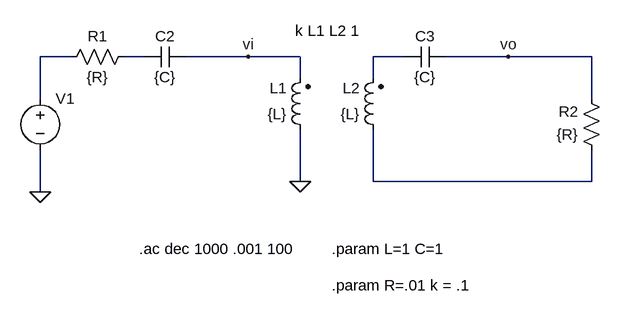
[diagram p0: schematic doble_sintonizado.asc]
doble_sintonizado.asc, the LTspice schematic file:
Version 4.1
SHEET 1 880 1328
WIRE -96 464 -144 464
WIRE 16 464 -16 464
WIRE 176 464 80 464
WIRE 256 464 176 464
WIRE 416 464 368 464
WIRE 576 464 480 464
WIRE 704 464 576 464
WIRE 256 496 256 464
WIRE 368 496 368 464
WIRE -144 528 -144 464
WIRE 704 528 704 464
WIRE 256 656 256 576
WIRE 368 656 368 576
WIRE 704 656 704 608
WIRE 704 656 368 656
WIRE -144 672 -144 608
FLAG -144 672 0
FLAG 176 464 vi
FLAG 576 464 vo
FLAG 256 656 0
SYMBOL voltage -144 512 R0
WINDOW 3 24 96 Invisible 2
SYMATTR Value 0
SYMATTR InstName V1
SYMATTR Value2 AC 1 0
SYMATTR SpiceLine Rser=0
SYMBOL res 0 448 R90
WINDOW 0 0 56 VBottom 2
WINDOW 3 32 56 VTop 2
SYMATTR InstName R1
SYMATTR Value {R}
SYMBOL res 720 624 R180
WINDOW 0 36 76 Left 2
WINDOW 3 36 40 Left 2
SYMATTR InstName R2
SYMATTR Value {R}
SYMBOL ind2 272 592 R180
WINDOW 0 36 80 Left 2
WINDOW 3 36 40 Left 2
SYMATTR InstName L1
SYMATTR Value {L}
SYMATTR Type ind
SYMATTR SpiceLine Rser=0
SYMBOL ind2 384 592 R180
WINDOW 0 36 80 Left 2
WINDOW 3 36 40 Left 2
SYMATTR InstName L2
SYMATTR Value {L}
SYMATTR Type ind
SYMATTR SpiceLine Rser=0
SYMBOL cap 80 448 R90
WINDOW 0 0 32 VBottom 2
WINDOW 3 32 32 VTop 2
SYMATTR InstName C2
SYMATTR Value {C}
SYMBOL cap 480 448 R90
WINDOW 0 0 32 VBottom 2
WINDOW 3 32 32 VTop 2
SYMATTR InstName C3
SYMATTR Value {C}
TEXT 8 760 Left 2 !.ac dec 1000 .001 100
TEXT 248 424 Left 2 !k L1 L2 1
TEXT 304 760 Left 2 !.param L=1 C=1
TEXT 304 816 Left 2 !.param R=.01 k = .1

The netlist it stands for:
* doble_sintonizado.asc
V1 N001 0 0 AC 1 0 Rser=0
R1 N002 N001 {R}
R2 N004 vo {R}
L1 0 vi {L} Rser=0
L2 N004 N003 {L} Rser=0
C2 vi N002 {C}
C3 vo N003 {C}
.ac dec 1000 .001 100
k L1 L2 1
.param L=1 C=1
.param R=.01 k = .1
.backanno
.end